# Altium schematic sheet B06B-PSILE-1(LF)(SN)1_B06B-PSILE-1(LF)(SN).schdoc
size 127 x 101 mm
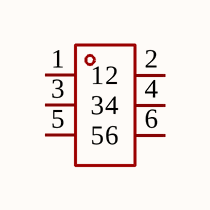
[diagram p0: B06B-PSILE-1(LF)(SN)1_B06B-PSILE-1(LF)(SN).schdoc]

## Parts
U?  B06B-PSILE-1(LF)(SN)  [CONN-TH_6P-P4.00_JST_B06B-PSILE-1-LF-SN]  (value not drawn)

## Nets

Not connected (* = marked no-connect by the designer): U? 1 2 3 4 5 6

## Library data of the parts
U? = B06B-PSILE-1(LF)(SN): Manufacturer: JST; Add into BOM: yes; Symbol: B06B-PSILE-1(LF)(SN); Device: B06B-PSILE-1(LF)(SN); LCSC Part Name: B06B-PSILE-1(LF)(SN); Supplier Part: C5305924; Manufacturer Part: B06B-PSILE-1(LF)(SN); Supplier Footprint: -; JLCPCB Part Class: Extended Part; Datasheet: https://atta.szlcsc.com/upload/public/pdf/source/20220125/269FDD7CCCA7D6F7CD97DE92C25BFCB0.pdf; Supplier: LCSC; Convert to PCB: yes